# Altium schematic sheet cpu1_gsm.SchDoc
size A3; DocumentNumber: 3; Revision: V1.0; SheetNumber: 3; SheetTotal: 9; Rule: PcbType=ProtelPcb
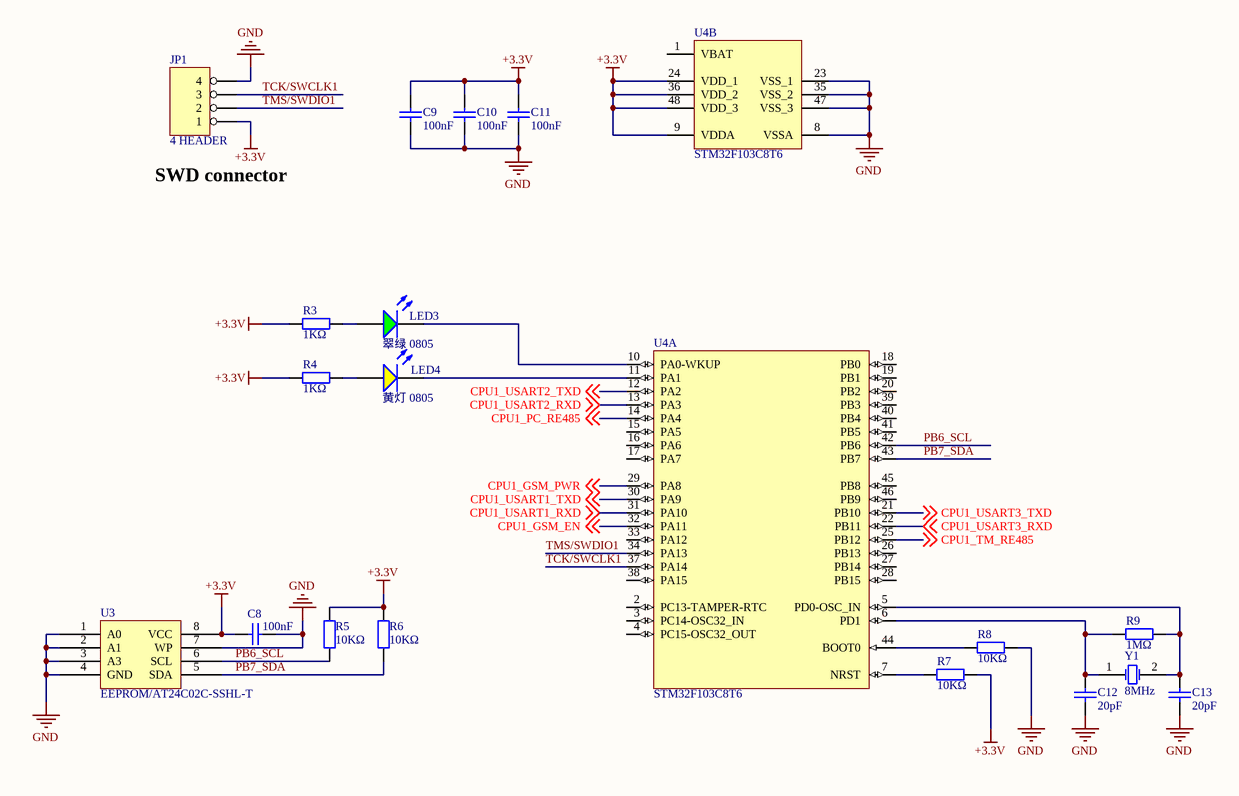
[diagram p0: cpu1_gsm.SchDoc]

## Parts
C8  100nF  [0805_C]
C9  100nF  [0805_C]
C10  100nF  [0805_C]
C11  100nF  [0805_C]
C12  20pF  [0805_C]
C13  20pF  [0805_C]
JP1  4 HEADER  [CON4_1.5]
LED3  翠绿 0805  [0805_LED_S1]
LED4  黄灯 0805  [0805_LED_S1]
R3  1KΩ  [0805_R]
R4  1KΩ  [0805_R]
R5  10KΩ  [0805_R]
R6  10KΩ  [0805_R]
R7  10KΩ  [0805_R]
R8  10KΩ  [0805_R]
R9  1MΩ  [0805_R]
U3  EEPROM/AT24C02C-SSHL-T  [SOIC-8_150mil]
U4  STM32F103C8T6  [LQFP-48_7x7x05P]  (parts A,B of 2)
Y1  8MHz  [XTAL_US1]

## Nets
+3.3V: C8.2 C9.2 C10.2 C11.2 JP1.1 R3.1 R4.1 R5.1 R6.1 R7.1 U3.8(VCC) U4.9(VDDA) U4.24(VDD_1) U4.36(VDD_2) U4.48(VDD_3)
GND: C8.1 C9.1 C10.1 C11.1 C12.1 C13.1 JP1.4 R8.1 U3.1(A0) U3.2(A1) U3.3(A3) U3.4(GND) U3.7(WP) U4.8(VSSA) U4.23(VSS_1) U4.35(VSS_2) U4.47(VSS_3)
CPU1_GSM_EN: U4.32(PA11) ; off-sheet CPU1_GSM_EN
CPU1_GSM_PWR: U4.29(PA8) ; off-sheet CPU1_GSM_PWR
CPU1_PC_RE485: U4.14(PA4) ; off-sheet CPU1_PC_RE485
CPU1_TM_RE485: U4.25(PB12) ; off-sheet CPU1_TM_RE485
CPU1_USART1_RXD: U4.31(PA10) ; off-sheet CPU1_USART1_RXD
CPU1_USART1_TXD: U4.30(PA9) ; off-sheet CPU1_USART1_TXD
CPU1_USART2_RXD: U4.13(PA3) ; off-sheet CPU1_USART2_RXD
CPU1_USART2_TXD: U4.12(PA2) ; off-sheet CPU1_USART2_TXD
CPU1_USART3_RXD: U4.22(PB11) ; off-sheet CPU1_USART3_RXD
CPU1_USART3_TXD: U4.21(PB10) ; off-sheet CPU1_USART3_TXD
PB6_SCL: R5.2 U3.6(SCL) U4.42(PB6)
PB7_SDA: R6.2 U3.5(SDA) U4.43(PB7)
TCK/SWCLK1: JP1.3 U4.37(PA14)
TMS/SWDIO1: JP1.2 U4.34(PA13)
NetC12_2: C12.2 R9.2 U4.6(PD1) Y1.1(OSC1)
NetC13_2: C13.2 R9.1 U4.5(PD0-OSC_IN) Y1.2(OSC2)
NetLED3_A: LED3.A R3.2
NetLED3_K: LED3.K U4.10(PA0-WKUP)
NetLED4_A: LED4.A R4.2
NetLED4_K: LED4.K U4.11(PA1)
NetR7_2: R7.2 U4.7(NRST)
NetR8_2: R8.2 U4.44(BOOT0)

Not connected (* = marked no-connect by the designer): U4 1(VBAT) 2(PC13-TAMPER-RTC) 3(PC14-OSC32_IN) 4(PC15-OSC32_OUT) 15(PA5) 16(PA6) 17(PA7) 18(PB0) 19(PB1) 20(PB2) 26(PB13) 27(PB14) 28(PB15) 33(PA12) 38(PA15) 39(PB3) 40(PB4) 41(PB5) 45(PB8) 46(PB9)

## Notes on the sheet
- (near JP1) SWD connector
- :

## Library data of the parts
C8-C13 = 0805 100nF(104) 10% 50V: 贴片电容; ComponentLink1Description: 供应商链接; ComponentLink1URL: http://www.szlcsc.com/product/details_50686.html; Package: 0805; Supplier: LC; SuppliersPartNumber: C49678
JP1 = 4 HEADER: 4 Pin Header
LED3 = 0805 翠绿: 发光二极管; ComponentLink1Description: 供应商链接; ComponentLink1URL: http://www.szlcsc.com/product/details_2670.html; Package: 0805; Supplier: LC; SuppliersPartNumber: C2297
LED4 = 0805 黄灯: 发光二极管; ComponentLink1Description: 供应商链接; ComponentLink1URL: http://www.szlcsc.com/product/details_2669.html; Package: 0805; Supplier: LC; SuppliersPartNumber: C2296
R3-R9 = 0805 11KΩ (1102) 1%: 贴片电阻; ComponentLink1Description: 供应商链接; ComponentLink1URL: http://www.szlcsc.com/product/details_18117.html; Package: 0805; Supplier: LC; SuppliersPartNumber: C17429
U3 = EEPROM/AT24C256C-SSHL-T: EEPROM; ComponentLink1Description: 供应商链接; ComponentLink1URL: http://www.szlcsc.com/product/details_6947.html; Package: SOIC-8_150mil; Supplier: LC; SuppliersPartNumber: C6482
U4 = STM32F103C8T6: ARM; ComponentLink1Description: 供应商链接; ComponentLink1URL: http://www.szlcsc.com/product/details_9243.html; Package: LQFP-48_7x7x05P; Supplier: LC; SuppliersPartNumber: C8734
Y1 = XTAL: Crystal Oscillator; Published: 8-Jun-2000; LatestRevisionDate: 17-Jul-2002; LatestRevisionNote: Re-released for DXP Platform.; Publisher: Altium Limited